# Altium schematic sheet DS18B20.SchDoc: =GlobalProjectName
size A4; ApprovedBy: Утвердил; CheckedBy: Проверил; Author: Разработал; SheetNumber: 3; SheetTotal: 10; PageSetup: Record=PageOptions|CenterHorizontal=True|CenterVertical=True|PrintScale=1.00|XCorrection=1.00|YCorrection=1.00|PrintKind=1|BorderSize=5000000|LeftOffset=0|BottomOffset=0|Orientation=2|PaperLength=1000|PaperWidth=1000|Scale=100|PaperSource=15|PrintQuality=1200|MediaType=1|DitherType=10|PaperKind=A3|PrintScaleMode=1; Weight: -; ScaleFactor: -; NormInspection: Норм.Контр.
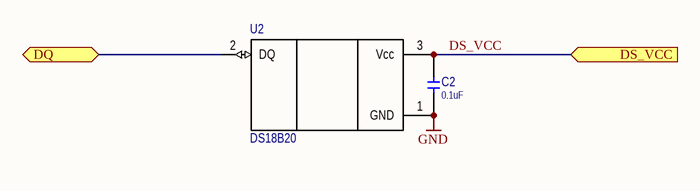
[diagram p0: DS18B20.SchDoc]

## Parts
C2  value 0.1uF  [CERCAP 0402]
U2  DS18B20  [TO-92]

## Ports
DQ (bidir), DS_VCC (in)

## Nets
GND: C2.1 U2.1(GND)
DQ: U2.2(DQ) ; port DQ
DS_VCC: C2.2 U2.3(Vcc) ; port DS_VCC

## Notes on the sheet
- Title
- Size:
- Date:
- A4
- Number:
- Time:
- Revision:
- Sheet
- of
- File:

## Library data of the parts
C2 = !Capacitor: Capacitor; IsSMT: NoSMT; Diel: X7R; Voltage: *
U2 = DS18B20: Temp; IsSMT: NoSMT